# Altium schematic sheet 05_Output.SchDoc
size A; SheetNumber: 5; SheetTotal: 8
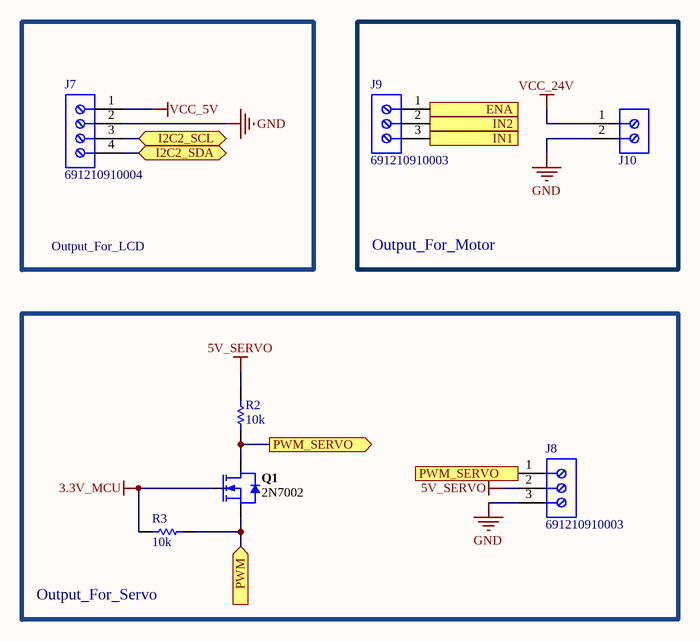
[diagram p0: 05_Output.SchDoc]

## Parts
J7  691210910004  [691210910004]
J8  691210910003  [691210910003]
J9  691210910003  [691210910003]
J10  691137710002  [691137710002]  (value not drawn)
Q1  2N7002  [SOT23-123]
R2  value 10k  [RES-SM-0603]  (hidden comment: ESR03EZPF1002)
R3  value 10k  [RES-SM-0603]  (hidden comment: ESR03EZPF1002)

## Blocks framed on the sheet
Output_For_LCD: J7
Output_For_Motor: J9 J10
Output_For_Servo: J8 Q1 R2 R3

## Ports
ENA (in), I2C2_SCL (bidir), I2C2_SDA (bidir), IN1 (in), IN2 (in), PWM (in), PWM_SERVO (in), PWM_SERVO (out)

## Nets
3.3V_MCU: Q1.1(G) R3.1
5V_SERVO: J8.2 R2.2
GND: J7.2 J8.3 J10.2
VCC_5V: J7.1
VCC_24V: J10.1
ENA: J9.1 ; port ENA
I2C2_SCL: J7.3 ; port I2C2_SCL
I2C2_SDA: J7.4 ; port I2C2_SDA
IN1: J9.3 ; port IN1
IN2: J9.2 ; port IN2
PWM: Q1.3(S) R3.2 ; port PWM
PWM_SERVO: J8.1 Q1.2(D) R2.1 ; port PWM_SERVO

## Library data of the parts
J7 = 691210910004: WR-TBL Serie 2109 Horizontal Entry, Rising Cage Clamp, pitch 2.54mm, 4p; Compliance: Lead free / RoHS; Modularity: No; PCB/Cable/Panel: PCB; Pin Number: 4; Rated Current [UL]: 6A; Working Voltage [UL]: 150VAC; No. Pad (SMD): 0; ComponentLink1Description: Manufacturer; ComponentLink1URL: http://www.we-online.de; ComponentLink2URL: https://katalog.we-online.de/em/datasheet/691210910004.pdf; ComponentLink2Description: Datasheet; Mounting Technology: THT; Part Number: 691210910004; Packaging: Box; Operating Temperature: -40 to +105degC; Pitch: 2.54mm; Published Date: October 2019; Type: Horizontal; Publisher: Wurth Elektronik; Application: Rising Cage Clamp; No. Pad (THT): 4; Unit Price (Digikey): 1.96
J8 J9 = 691210910003: WR-TBL Serie 2109 Horizontal Entry, Rising Cage Clamp, pitch 2.54mm, 3p; Compliance: Lead free / RoHS; Modularity: No; PCB/Cable/Panel: PCB; Pin Number: 3; Rated Current [UL]: 6A; Working Voltage [UL]: 150VAC; No. Pad (SMD): 0; ComponentLink1Description: Manufacturer; ComponentLink1URL: http://www.we-online.de; ComponentLink2URL: https://katalog.we-online.de/em/datasheet/691210910003.pdf; ComponentLink2Description: Datasheet; Mounting Technology: THT; Part Number: 691210910003; Packaging: Box; Operating Temperature: -40 to +105degC; Pitch: 2.54mm; Published Date: October 2019; Type: Horizontal; Publisher: Wurth Elektronik; Application: Rising Cage Clamp; No. Pad (THT): 3; Unit Price (Digikey): 1.55
J10 = 691137710002: WR-TBL Series 1377 Horizontal Entry, Through Hole, pitch 5mm, 2p; Manufacturer: Wurth Elektronik; Pin Number: 2; Rated Current: 16A; Working Voltage: 300V; PCB/Cable/Panel: PCB; Modularity: No; No. Pad (SMD): 0; ComponentLink1Description: Manufacturer Link; ComponentLink1URL: https://www.we-online.com/redexpert/article/691137710002?ad; ComponentLink2Description: Datasheet; ComponentLink2URL: https://www.we-online.com/redexpert/spec/691137710002?ad; Category: Terminal Blocks; Match Code: WR-TBL; Manufacturer Part Number: 691137710002; Mount: Through Hole; Operating Temperature Max: 120°C; Operating Temperature Min: -30°C; Packaging: Box; Pitch: 5mm; Orientation: Horizontal; Application: Pressure Clamp; No. Pad (THT): 2; Unit Price (Digikey): 0.41
Q1 = 2N7002: N-Channel 60 V 340mA (Ta) 350mW (Ta) Surface Mount SOT-23; Mfr: Yangzhou Yangjie Electronic Technology Co.,Ltd; Transistor Type: NPN; No. Pad (SMD): 3; No. Pad (THT): 0; Drain to Source Voltage (Vdss): 60 V; Drive Voltage (Max Rds On, Min Rds On): 4.5V, 10V; Rds On (Max) @ Id, Vgs: 2.5Ohm @ 300mA, 10V; Vgs(th) (Max) @ Id: 2.5V @ 250µA; Gate Charge (Qg) (Max) @ Vgs: 1.6 nC @ 10 V; Vgs (Max): ±30V; Input Capacitance (Ciss) (Max) @ Vds: 27.5 pF @ 30 V; Parameter 3: Package / Case; Mounting Technology: Surface Mount; Status: Unreleased; Category: Transistor-FET; Unit Price (Digikey): 0.29; ComponentLink1Description: Digikey; ComponentLink1URL: https://www.digikey.com/en/products/detail/yangzhou-yangjie-electronic-technology-co-ltd/2N7002/13911639; FET Type: N-Channel; Technology: MOSFET (Metal Oxide); Current - Continuous Drain (Id) @ 25°C: 340mA (Ta); Power Dissipation (Max): 350mW (Ta); Operating Temperature: -55°C ~ 150°C (TJ); Mounting Type: Surface Mount; Supplier Device Package: SOT-23
R2 R3 = RESISTOR SMD: RES SMD 10K OHM 1% 1/4W 0603; Mfr: Rohm Semiconductor; No. Pad (SMD): 2; No. Pad (THT): 0; Resistance: 10 kOhms; Power (Watts): 0.25W, 1/4W; Temperature Coefficient: ±100ppm/°C; Ratings: AEC-Q200*; Unit Price (Digikey): 0.15; Category: Resistors; Series: ESR; Tolerance: ±1%; Composition: Thick Film; Features: Automotive AEC-Q200, Pulse Withstanding; Operating Temperature: -55°C ~ 155°C; Package / Case: 0603 (1608 Metric); Supplier Device Package: 0603; Size / Dimension: 0.063" L x 0.031" W (1.60mm x 0.80mm); Height - Seated (Max): 0.022" (0.55mm); Number of Terminations: 2